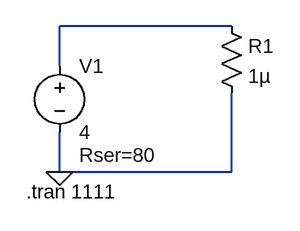
[diagram p0: schematic lab1.asc]
lab1.asc, the LTspice schematic file:
Version 4.1
SHEET 1 880 680
WIRE 336 0 128 0
WIRE 128 48 128 0
WIRE 128 176 128 128
WIRE 336 176 336 80
WIRE 336 176 128 176
FLAG 128 176 0
SYMBOL voltage 128 32 R0
WINDOW 123 0 0 Left 0
WINDOW 39 24 124 Left 2
SYMATTR InstName V1
SYMATTR Value 4
SYMATTR SpiceLine Rser=80
SYMBOL res 320 -16 R0
SYMATTR InstName R1
SYMATTR Value 1µ
TEXT 88 200 Left 2 !.tran 1111

The netlist it stands for:
* lab1.asc
V1 N001 0 4 Rser=80
R1 N001 0 1µ
.tran 1111
.backanno
.end